# Altium schematic sheet AD9361 Power.SchDoc
size A4
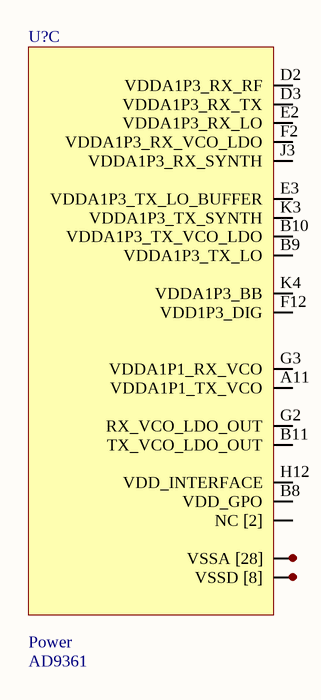
[diagram p0: AD9361 Power.SchDoc]

## Parts
U?  AD9361  [BGA144C80P12X12_1000X1000X170]  (part C of 4)

## Nets
NetU?_A3: U?.A3(NC_[2]) U?.M3(M14)
NetU?_A4: U?.A4(VSSA_[28]) U?.A6 U?.B1(M15) U?.B2(M16) U?.B12(M17) U?.C2(M18) U?.C7(M19) U?.C8(M20) U?.C9(M22) U?.C10(M21) U?.C11(M23) U?.C12(M24) U?.F3(M26) U?.H2(M25) U?.H3(M13) U?.H6(M14) U?.J2(M15) U?.K2(M16) U?.L2(M17) U?.L3(M18) U?.L7(M19) U?.L8(M20) U?.L9(M21) U?.L10(M22) U?.L11(M23) U?.L12(M24) U?.M4(M25) U?.M6(M26)
NetU?_D12: U?.D12(VSSD_[8]) U?.F7(M14) U?.F9(M15) U?.F11(M16) U?.G12(M17) U?.H7(M18) U?.H10(M19) U?.K12(M20)

Not connected (* = marked no-connect by the designer): U? A11(VDDA1P1_TX_VCO) B8(VDD_GPO) B9(VDDA1P3_TX_LO) B10(VDDA1P3_TX_VCO_LDO) B11(TX_VCO_LDO_OUT) D2(VDDA1P3_RX_RF) D3(VDDA1P3_RX_TX) E2(VDDA1P3_RX_LO) E3(VDDA1P3_TX_LO_BUFFER) F2(VDDA1P3_RX_VCO_LDO) F12(VDD1P3_DIG) G2(RX_VCO_LDO_OUT) G3(VDDA1P1_RX_VCO) H12(VDD_INTERFACE) J3(VDDA1P3_RX_SYNTH) K3(VDDA1P3_TX_SYNTH) K4(VDDA1P3_BB)

## Notes on the sheet
- Title
- Size:
- Date:
- A3
- Drawn by:
- Time:
- Revision:
- Sheet
- of
- File:
- (in symbol AD9361, part C) Power

## Library data of the parts
U? = AD9361: RF Agile Transceiver 2Tx x 2Rx